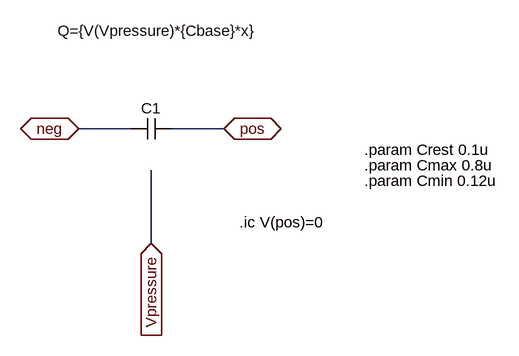
[diagram p0: schematic SENSOR_CAP.asc]
SENSOR_CAP.asc, the LTspice schematic file:
Version 4
SHEET 1 968 680
WIRE 400 336 320 336
WIRE 544 336 464 336
WIRE 432 512 432 400
FLAG 432 512 Vpressure
IOPIN 432 512 In
FLAG 320 336 neg
IOPIN 320 336 BiDir
FLAG 544 336 pos
IOPIN 544 336 BiDir
SYMBOL cap 464 320 R90
WINDOW 0 0 32 VBottom 2
WINDOW 3 -150 22 VTop 2
SYMATTR InstName C1
SYMATTR Value Q={V(Vpressure)*{Cbase}*x}
TEXT 568 480 Left 2 !.ic V(pos)=0
TEXT 760 368 Left 2 !.param Crest 0.1u
TEXT 760 392 Left 2 !.param Cmax 0.8u
TEXT 760 416 Left 2 !.param Cmin 0.12u

The netlist it stands for:
* SENSOR_CAP.asc
C1 pos neg Q={V(Vpressure)*{Cbase}*x}
.ic V(pos)=0
.param Crest 0.1u
.param Cmax 0.8u
.param Cmin 0.12u
.backanno
.end